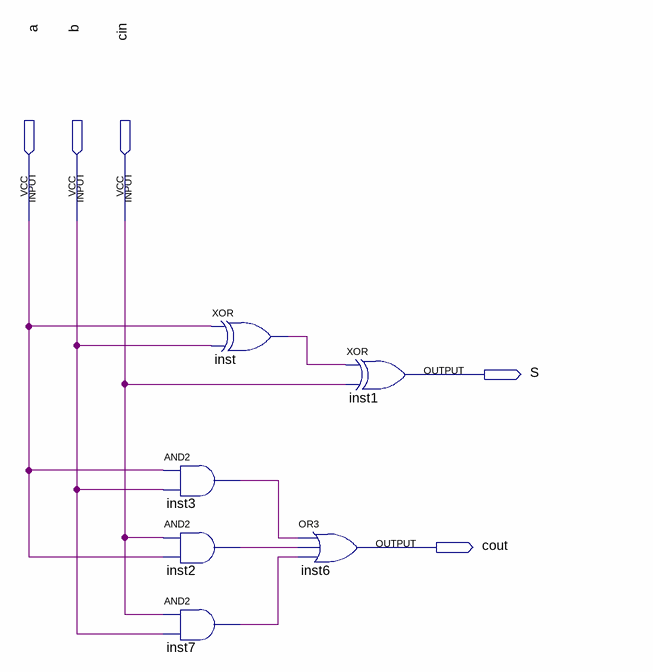
[diagram p0: schematic sheet]
// Quartus schematic FullAdder.bdf as structural Verilog: 6 symbols, 5 pins
module FullAdder (
  input  a,
  input  b,
  input  cin,
  output S,
  output cout
);

  wire inst2_out, inst3_out, inst7_out, inst_out;

  and inst3 (inst3_out, a, b);
  and inst2 (inst2_out, cin, a);
  and inst7 (inst7_out, cin, b);
  xor inst (inst_out, a, b);
  xor inst1 (S, inst_out, cin);
  or inst6 (cout, inst3_out, inst2_out, inst7_out);
endmodule
